# Altium project Wacky_Racers_87557913.PrjPcb
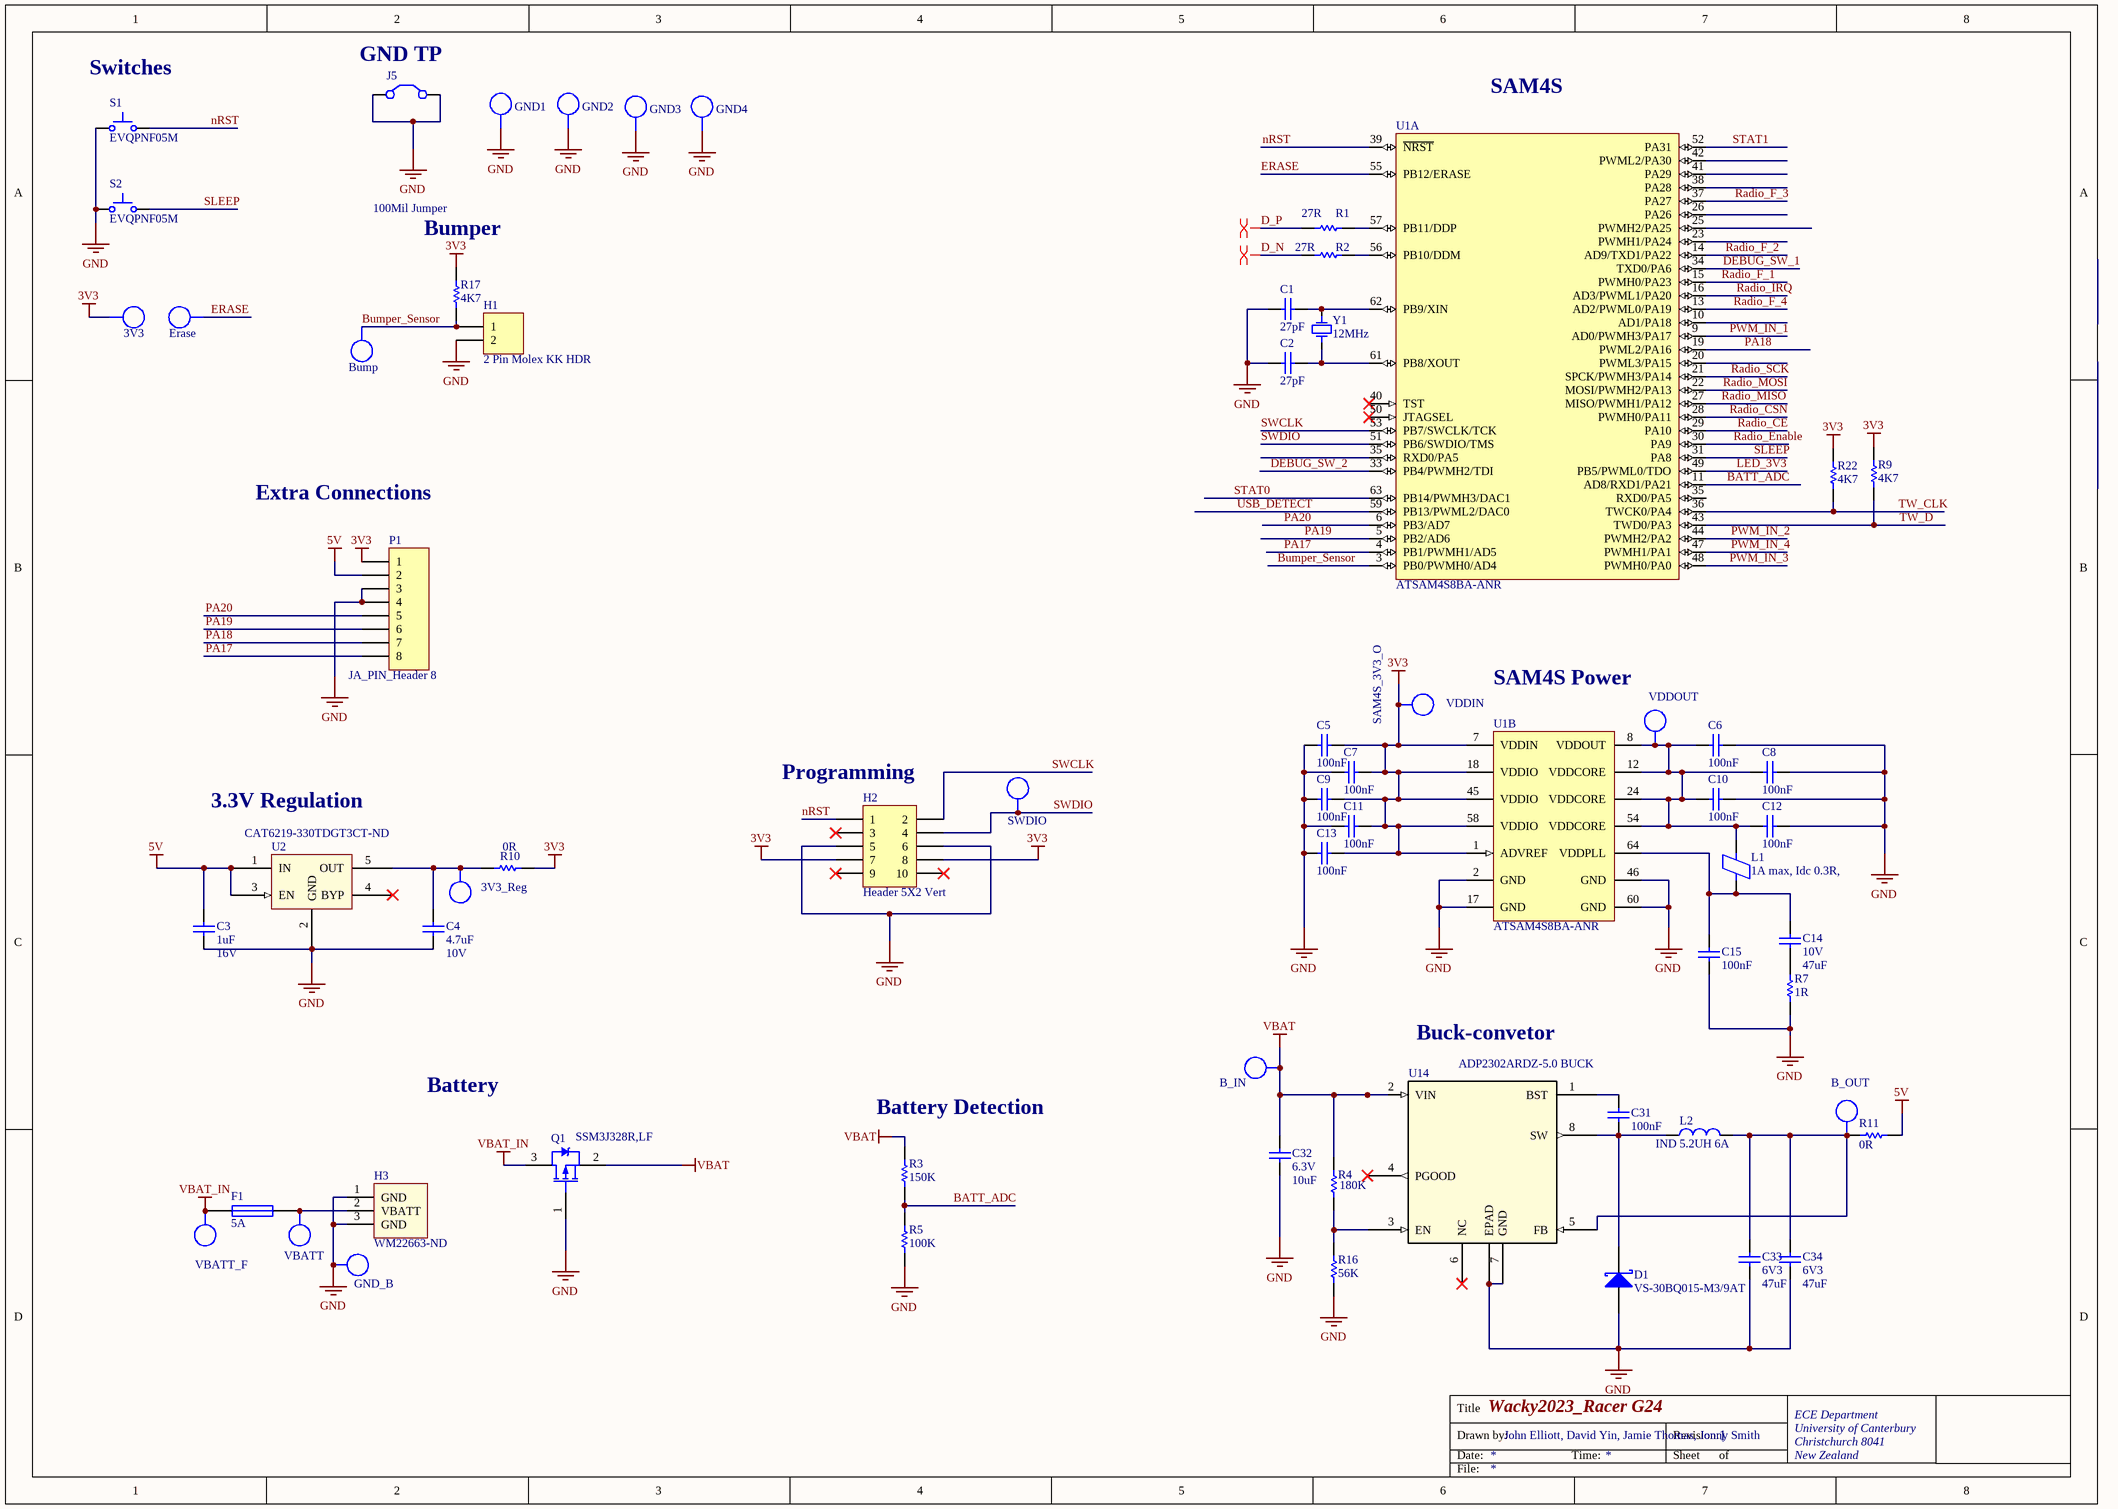
[diagram p0: Wacky_Racers_87557913.SchDoc]
2 sheets, 115 parts. Net scope: global (net labels, ports and power ports of the same name join across sheets).
Board file: Group24_87557913_98040483_PCB_Wacky_R_CAR.PcbDoc
Sheets:
  Wacky_Racers_87557913.SchDoc
  Wacky_Racers_extras.SchDoc

## Sheet Wacky_Racers_87557913.SchDoc: Wacky2023_Racer G24
size A3; DrawnBy: John Elliott, David Yin, Jamie Thomas, Jonny Smith; Address1: ECE Department; Address2: University of Canterbury; Address3: Christchurch 8041; Address4: New Zealand; Revision: 1; ImagePath: \\maxwell\elecapp\AltiumDesigner\Templates\uc-logo.png

### Parts
3V3  TP  [TP_1206]  (value not drawn)  (no BOM)
3V3_Reg  TP  [TP_1206]  (value not drawn)  (no BOM)
B_IN  TP  [TP_1206]  (value not drawn)  (no BOM)
B_OUT  TP  [TP_1206]  (value not drawn)  (no BOM)
Bump  TP  [TP_1206]  (value not drawn)  (no BOM)
C1  27pF  [CAPC1608L]
C2  27pF  [CAPC1608L]
C3  Max Voltage: 16V  [CAPC1608L]  (hidden comment: 1uF)
C4  Max Voltage: 10V  [CAPC1608N]  (hidden comment: 4.7uF)
C5  100nF  [CAPC1608L]
C6  100nF  [CAPC1608L]
C7  100nF  [CAPC1608L]
C8  100nF  [CAPC1608L]
C9  100nF  [CAPC1608L]
C10  100nF  [CAPC1608L]
C11  100nF  [CAPC1608L]
C12  100nF  [CAPC1608L]
C13  100nF  [CAPC1608L]
C14  Max Voltage: 10V  [CAPC3216L]  (hidden comment: 47uF)
C15  100nF  [CAPC1608L]
C31  100nF  [CAPC1608L]
C32  Voltage - Rated: 6.3V  [CAPC1608L]  (hidden comment: 10uF)
C33  Voltage Rating: 6V3  Capacitance: 47uF  [CAPC2012N]  (hidden comment: CC_47uF_0805_6V3)
C34  Voltage Rating: 6V3  Capacitance: 47uF  [CAPC2012N]  (hidden comment: CC_47uF_0805_6V3)
D1  VS-30BQ015-M3/9AT  [SMC]
Erase  TP  [TP_1206]  (value not drawn)  (no BOM)
F1  5A  [RESC3216N]
GND1  TP  [TP_1206]  (value not drawn)  (no BOM)
GND2  TP  [TP_1206]  (value not drawn)  (no BOM)
GND3  TP  [TP_1206]  (value not drawn)  (no BOM)
GND4  TP  [TP_1206]  (value not drawn)  (no BOM)
GND_B  TP  [TP_1206]  (value not drawn)  (no BOM)
H1  2 Pin Molex KK HDR  [MOLEX_KK_2_HDR]
H2  Header 5X2 Vert  [IDC2.54-V10D]
H3  Supplier Part Number 1: WM22663-ND  [BATT_HEADER_3POS]  (hidden comment: Battery_HEADER_3pin)
J5  100Mil Jumper  [JMP2.54]
L1  1A max, Idc 0.3R,  [INDC3216L]
L2  IND 5.2UH 6A  [INDUCTOR5u2]
P1  JA_PIN_Header 8  [HDR1X8]
Q1  SSM3J328R,LF  [SOT23_L]
R1  27R  [RESC1608L]
R2  27R  [RESC1608L]
R3  150K  [RESC1608L]
R4  value 180K  [RESC1608L]
R5  100K  [RESC1608L]
R7  1R  [RESC3216L]
R9  4K7  [RESC1608L]
R10  0R  [RESC1608L]
R11  0R  [RESC1608L]
R16  56K  [RESC1608L]
R17  4K7  [RESC1608L]
R22  4K7  [RESC1608L]
S1  EVQPNF05M  [EVQPNF05M]
S2  EVQPNF05M  [EVQPNF05M]
SWDIO  TP  [TP_1206]  (value not drawn)  (no BOM)
U1  ATSAM4S8BA-ANR  [LQFP64_L]  (parts A,B of 2)
U2  Supplier Part Number: CAT6219-330TDGT3CT-ND  [SOT95P280X145-5N]  (hidden comment: CAT6219-330TDGT3)
U14  ADP2302ARDZ-5.0 BUCK  [RD_8_1]
VBATT  TP  [TP_1206]  (value not drawn)  (no BOM)
VBATT_F  TP  [TP_1206]  (value not drawn)  (no BOM)
VDDIN  TP  [TP_1206]  (value not drawn)  (no BOM)
VDDOUT  TP  [TP_1206]  (value not drawn)  (no BOM)
Y1  12MHz  [6.0X3.5-4]

### Nets
3V3: 3V3.1 C5.2 C7.2 C9.2 C11.2 C13.1 H2.7 H2.8 P1.1 R9.1 R10.2 R17.2 R22.1 U1.1(ADVREF) U1.7(VDDIN) U1.18(VDDIO) U1.45(VDDIO) U1.58(VDDIO) VDDIN.1
5V: C3.2 P1.2 R11.1 U2.1(IN) U2.3(EN)
GND: C1.1 C2.1 C3.1 C4.1 C5.1 C6.2 C7.1 C8.2 C9.1 C10.2 C11.1 C12.2 C13.2 C15.1 C32.1 C33.1 C34.1 D1.1(A) GND1.1 GND2.1 GND3.1 GND4.1 GND_B.1 H1.2 H2.5 H2.6 H3.1(GND) H3.3(GND) J5.1(C1) J5.2(C2) P1.3 P1.4 Q1.1 R5.1 R7.1 R16.1 S1.1 S2.1 U1.2(GND) U1.17(GND) U1.46(GND) U1.60(GND) U2.2(GND) U14.7(GND) U14.EPAD
VBAT: B_IN.1 C32.2 Q1.2 R3.2 R4.2 U14.2(VIN)
VBAT_IN: F1.1 Q1.3 VBATT_F.1
BATT_ADC: R3.1 R5.2 U1.11(AD8/RXD1/PA21)
Bumper_Sensor: Bump.1 H1.1 R17.1 U1.3(PB0/PWMH0/AD4)
D_N: R2.1
D_P: R1.1
DEBUG_SW_1: U1.34(TXD0/PA6)
DEBUG_SW_2: U1.33(PB4/PWMH2/TDI)
ERASE: Erase.1 U1.55(PB12/ERASE)
LED_3V3: U1.49(PB5/PWML0/TDO)
nRST: H2.1 S1.2 U1.39(~{NRST})
PA17: P1.8 U1.4(PB1/PWMH1/AD5)
PA18: P1.7 U1.19(PWML2/PA16)
PA19: P1.6 U1.5(PB2/AD6)
PA20: P1.5 U1.6(PB3/AD7)
PWM_IN_1: U1.9(AD0/PWMH3/PA17)
PWM_IN_2: U1.44(PWMH2/PA2)
PWM_IN_3: U1.48(PWMH0/PA0)
PWM_IN_4: U1.47(PWMH1/PA1)
Radio_CE: U1.29(PA10)
Radio_CSN: U1.28(PWMH0/PA11)
Radio_Enable: U1.30(PA9)
Radio_F_1: U1.15(PWMH0/PA23)
Radio_F_2: U1.14(AD9/TXD1/PA22)
Radio_F_3: U1.37(PA27)
Radio_F_4: U1.13(AD2/PWML0/PA19)
Radio_IRQ: U1.16(AD3/PWML1/PA20)
Radio_MISO: U1.27(MISO/PWMH1/PA12)
Radio_MOSI: U1.22(MOSI/PWMH2/PA13)
Radio_SCK: U1.21(SPCK/PWMH3/PA14)
SLEEP: S2.2 U1.31(PA8)
STAT0: U1.63(PB14/PWMH3/DAC1)
STAT1: U1.52(PA31)
SWCLK: H2.2 U1.53(PB7/SWCLK/TCK)
SWDIO: H2.4 SWDIO.1 U1.51(PB6/SWDIO/TMS)
TW_CLK: R22.2 U1.36(TWCK0/PA4)
TW_D: R9.2 U1.43(TWD0/PA3)
USB_DETECT: U1.59(PB13/PWML2/DAC0)
Net3V3_Reg_1: 3V3_Reg.1 C4.2 R10.1 U2.5(OUT)
NetB_OUT_1: B_OUT.1 C33.2 C34.2 L2.2 R11.2 U14.5(FB)
NetC1_2: C1.2 U1.62(PB9/XIN) Y1.3(OSC2)
NetC2_2: C2.2 U1.61(PB8/XOUT) Y1.1(OSC1)
NetC6_1: C6.1 C8.1 C10.1 C12.1 L1.2 U1.8(VDDOUT) U1.12(VDDCORE) U1.24(VDDCORE) U1.54(VDDCORE) VDDOUT.1
NetC14_1: C14.1 R7.2
NetC14_2: C14.2 C15.2 L1.1 U1.64(VDDPLL)
NetC31_1: C31.1 D1.2(K) L2.1 U14.8(SW)
NetC31_2: C31.2 U14.1(BST)
NetF1_2: F1.2 H3.2(VBATT) VBATT.1
NetR1_2: R1.2 U1.57(PB11/DDP)
NetR2_2: R2.2 U1.56(PB10/DDM)
NetR4_1: R4.1 R16.2 U14.3(EN)

Not connected (* = marked no-connect by the designer): H2 3* 9* 10*; U1 10(AD1/PA18) 20(PWML3/PA15) 23(PWMH1/PA24) 25(PWMH2/PA25) 26(PA26) 35(RXD0/PA5) 38(PA28) 40(TST)* 41(PA29) 42(PWML2/PA30) 50(JTAGSEL)*; U2 4(BYP)*; U14 4(PGOOD)* 6(NC)*

### Layout directives
differential pair: D_N, D_P

### Notes on the sheet
- (near S1) Switches
- (near J5) GND TP
- (near U1) SAM4S
- (near R17) Bumper
- Extra Connections
- (near VDDIN) SAM4S_3V3_O
- SAM4S Power
- (near H2) Programming
- 3.3V Regulation
- (near U14) Buck-convetor
- Battery
- (near R3) Battery Detection
- Title
- Drawn by:
- Date:
- Time:
- Revision:
- Sheet
- of
- File:

### Library data of the parts
3V3 3V3_Reg B_IN B_OUT Bump Erase GND1-GND4 GND_B SWDIO VBATT VBATT_F VDDIN VDDOUT = TP_1206: Test-Point 3.3x1.6x2.1mm SMD; Manufacturer: Harwin Inc; Manufacturer Part Number: S1751-46R; Manufacturer PN: *; Storage Location: ProtoPlace; Mounting Type: Surface Mount; Type: PC Test Point; Supplier 1: Digi-Key; Supplier Part Number 1: 952-1478-2-ND; Supplier 2: Farnell; Supplier Part Number 2: 1826282; Supplier: ECE Dept; Value: TP
C1 C2 = CC_27pF_0603: CAP CER 27pF NPO/COG +-5% 50V 0603; PackageReference: 0603; Code_IPC: 1608 [0603]; Verify: *; Supplier: ECE Dept; Storage Location: PCB Assembly WS; Value: 27pF
C3 = CC_1uF_0603: CAP CER 1uF Y5V -20% +80% 16V 0603; PackageReference: 0603; Code_IPC: 1608 [0603]; Verify: *; Supplier: ECE Dept; Storage Location: PCB Assembly WS; Value: 1uF
C4 = CC_4.7uF_0603: CAP CER 4.7uF X5R +-20%  10V 0603; Note: Footprint corresponds to dimensions for bulk cassette packaging. This case size has tightened tolerances.; PackageReference: 0805; Code_IPC: 2012[0805]; Verify: *; Supplier: ECE Dept; Storage Location: PCB Assembly WS; Value: 4.7uF
C5-C13 C15 C31 = CC_100nF_0603: CAP CER 100nF X7R +-10% 50V 0603; PackageReference: 0603; Code_IPC: 1608 [0603]; Verify: *; Supplier: ECE Dept; Storage Location: PCB Assembly WS; Value: 100nF
C14 = CC_47uF_1206: CAP CER 47uF X5R -/+20% 10V 1206; Verify: *; Supplier: ECE Dept; Storage Location: PCB Assembly WS; Dielectric: X5R; Footprint: 1210 (3225 metric); MoV: 10V; Value: 47uF
C32 = CC_10uF_0603: CAP CER 10UF X5R +-20% 6V3 0603; Supplier: ECE Dept; Storage Location: PCB Assembly WS; Value: 10uF
C33 C34 = CC_47uF_0805_6V3: SAMSUNG ELECTRO-MECHANICS - CL21A476MQCLRNC - CAP, 47UF, 6.3V, MLCC, 0805; Tolerance: 20%; Dielectric: X5R; Supplier 1: Digi-Key; Manufacturer 1: Samsung; Manufacturer Part Number 1: CL21A476MQCLRNC; Stock 1: 94580; Pricing 1: 1=0.56000, 10=0.39100, 50=0.27380, 100=0.23470, 500=0.17602, 1000=0.14865 (USD); RoHS: Yes; Mount: Surface Mount; Case/Package: 0805; Case Code (Metric): 2012; Case Code (Imperial): 0805; Contact Plating: Tin; Min Operating Temperature: -55°C; Max Operating Temperature: 85°C; Packaging: Tape and Reel; Package Quantity: 4000; Termination: Wraparound; Series: CL; Construction: Flat; Length: 2mm; Width: 0.049inch; Thickness: 0.037inch; Depth: 1.25mm; Lead Free: Lead Free; RoHS Compliant: Yes; ComponentLink1URL: https://datasheet.ciiva.com/25723/cl21a476mqclrnc-25723991.pdf?src-supplier=Digi-Key; ComponentLink1Description: https://datasheet.ciiva.com/25723/cl21a476mqclrnc-25723991.pdf?src-supplier=Digi-Key; Supplier Part Number 1: 1276-2420-1-ND
D1 = DS_VS-30BQ015-M3: DIODE, SCHOTTKY, 3A, 15V, DO-214AB / SMC; Manufacturer: Vishay Semiconductors; Forward Voltage: 350mV; Max Forward Surge Current (Ifsm): 650A; Peak Reverse Current: 4mA; Average Rectified Current: 3A; Max Reverse Voltage (DC): 15V; Supplier: Digi-Key; ComponentLink1URL: https://datasheet.ciiva.com/36181/vs-30bq015-m3-9at-36181258.pdf; ComponentLink1Description: https://datasheet.ciiva.com/36181/vs-30bq015-m3-9at-36181258.pdf; Supplier 1: Digi-Key; Supplier 2: Element14; Supplier Part Number 1: VS-30BQ015-M3/9ATGIDKR-ND; Supplier Part Number 2: 2628288; Supplier Part Number: VS-30BQ015-M3/9AT-ND; Manufacturer Part Number: VS-30BQ015-M3/9AT
F1 = FS_Fuse_5.0A: Fuse 5.0A Fast Acting 1206 SMD; Manufacturer Part Number: C1F5; Manufacturer: Bel TRP; Voltage Rating (AC): 125V; Voltage Rating (DC): 63V; DC Cold Resistance: 19mR; Fuse Type: Board Mount (Cartridge Style Excluded); Approvals: CE,cURus; Mount: Surface Mount; Case/Package: 1206; Number of Pins: 2; Case Code (Metric): 3216; Case Code (Imperial): 1206; Contact Plating: Nickel,Tin; Min Operating Temperature: -55°C; Max Operating Temperature: 125°C; Packaging: Tape and Reel; Voltage Rating: 125V; Length: 0.126inch; Width: 0.062inch; Supplier 1: Digi-Key; Stock 1: 725; Pricing 1: 1=0.32, 5=0.312, 10=0.298, 50=0.2662, 100=0.2479, 250=0.22032, 500=0.1836, 1000=0.17442 (USD); ComponentLink1URL: http://www.farnell.com/datasheets/2571625.pdf; ComponentLink1Description: http://www.farnell.com/datasheets/2571625.pdf; ComponentLink2URL: http://belfuse.com/pdfs/C1F.pdf; ComponentLink2Description: http://belfuse.com/pdfs/C1F.pdf; ComponentLink3URL: http://www.mouser.com/ds/2/643/C1F-594910.pdf; ComponentLink3Description: http://www.mouser.com/ds/2/643/C1F-594910.pdf; ComponentLink4URL: https://belfuse.com/resources/StewartConnector/C1F.pdf; ComponentLink4Description: https://belfuse.com/resources/StewartConnector/C1F.pdf; Current Rating: 5A; Supplier Part Number 1: 507-1886-1-ND; Supplier 2: Element14; Supplier Part Number 2: 2848595; Value: 5A
H1 = JA_MOLEX_KK_2POS: CONN HEADER 2POS 2.54mm VERT_Thru Hole; Supplier 1: Farnell; Supplier Part Number 1: 1462926; Supplier: ECE Dept; Storage Location: ECE Dept Store; Value: 2 Pin Molex KK HDR
H2 = JA_HDR_IDC_5X2_VERT: IDC Header, 2,54mm, 10-Pin, Vert; Supplier: ECE Dept; Supplier 1: Farnell; Supplier Part Number 1: 1096985; Storage Location: ECE Dept Store
H3 = Battery_HEADER_3pin: 3Pin Header 2.54mm spacing / Digikey #WM22663-ND; Supplier 1: Digi-Key
J5 = TP_JUMPER: 2.54mm Jumper Thru Hole; Pitch Spacing: 2.54; No. of Rows: 1; No. of Positions: 2; Supplier: ECE Dept; Supplier 1: Farnell; Supplier Part Number 1: 1097975; Storage Location: ECE$ Store
L1 = IN_Ferrite-Bead: Ferrite Bead, Rdc 0.3R, Z100MHZ 600R, Imax 1A, SMD 1206; Manufacturer: FAIR-RITE; Manufacturer PN: 2512066017Y1; DC Current Rating: 1; DC Resistance Max: 0.08; Ferrite Case Style: 1206 ^3216 Metric]; Frequency Range: 50MHz to 1; Impedance: 600; Impedance Tolerance: ± 25%; Supplier: ECE Dept; Storage Location: PCB Assembly WS; Ferrite Mounting: SMD; Supplier 1: Farnell; Supplier Part Number 1: 1612060; Manufacturer Part Number: 2512066017Y1; Value: 1A max, Idc 0.3R,
L2 = CDRH104RNP-5R2NC: FIXED IND 5.2UH 6A 22 MOHM SMD; Manufacturer: Sumida America Components Inc.; Material - Core: Ferrite; Tolerance: ±30%; Current - Saturation: 5.6A; Shielding: Shielded; DC Resistance (DCR): 22 mOhm Max; Supplier 1: Digi-Key; Manufacturer Part Number: CDRH104RNP-5R2NC; RoHS: RoHS Compliant; Category: Inductors, Coils, Chokes; Stock 1: 3849; Pricing 1: 1=2.9, 10=2.678, 100=1.8743, 500=1.5173 (NZD); Packaging: Cut Tape (CT); Part Status: Active; Type: -; Q @ Freq: -; Frequency - Self Resonant: -; Ratings: -; Operating Temperature: -40°C ~ 100°C; Mounting Type: Surface Mount; Package / Case: Nonstandard; Supplier Device Package: -; Size / Dimension: 0.402" L x 0.394" W (10.20mm x 10.00mm); Height - Seated (Max): 0.157" (4.00mm); ComponentLink1URL: http://products.sumida.com/products/pdf/CDRH104R.pdf; ComponentLink1Description: http://products.sumida.com/products/pdf/CDRH104R.pdf; Supplier Part Number 1: 308-2280-1-ND
P1 = JA_PIN_Header 8: Header, 8-Pin; LatestRevisionDate: 17-Jul-2002; LatestRevisionNote: Re-released for DXP Platform.; Publisher: Altium Limited
Q1 = TM_SSM3J328R: MOSFET P-CH 20V 6A SOT23-3; Manufacturer: Toshiba; FET Feature: Logic Level Gate, 1.5V Drive; FET Type: MOSFET P-Channel, Metal Oxide; Gate Charge (Qg) @ Vgs: 12.8nC @ 4.5V; Input Capacitance (Ciss) @ Vds: 840pF @ 10V; Power - Max: 1W; Rds On Max: 29.8mR; Drain to Source Resistance: 47.4mR; Turn-On Delay Time: 32ns; Power Dissipation: 2W; Number of Channels: 1; Turn-Off Delay Time: 107ns; Gate to Source Voltage (Vgs): 8V; Input Capacitance: 840pF; Element Configuration: Single; Drain to Source Breakdown Voltage: -20V; Vgs(th) (Max) @ Id: 1V @ 1mA; Current - Continuous Drain (Id) @ 25° C: 6A; Drain to Source Voltage (Vdss): 20V; Package / Case: SOT-23-3 Flat Leads; Supplier Device Package: SOT-23F; Pricing: 1=0.79, 10=0.658, 25=0.5772, 100=0.4939, 250=0.42836, 500=0.36284, 1000=0.27972 (NZD); Storage Location: PCB Assembly WS; Supplier: Digi-Key; ComponentLink1URL: https://datasheet.ciiva.com/11158/ssm3j328r-datasheet-en-20140301-11158652.pdf; ComponentLink1Description: https://datasheet.ciiva.com/11158/ssm3j328r-datasheet-en-20140301-11158652.pdf; Supplier Part Number: SSM3J328RLFDKR-ND; Max Operating Temperature: 150°C; Mount: Surface Mount; Packaging: Tape and Reel; Min Operating Temperature: -55°C; Continuous Drain Current (ID): 6A; Radiation Hardening: No; Max Power Dissipation: 1W; Package Quantity: 3000; Case/Package: SOT-23-3; Number of Pins: 3; Number of Elements: 1; Supplier 1: Digi-Key; Supplier Part Number 1: SSM3J328RLFDKR-ND; Manufacturer Part Number: SSM3J328R,LF
R1 R2 = RS_27R: RES 27 OHM 1/10W 5% 0603 SMD; Storage Location: PCB Assembly WS; Supplier: ECE Dept; Value: 27R
R3 = RS_150K: RES 150K OHM 1/10W 5% 0603 SMD; Storage Location: PCB Assembly WS; Supplier: ECE Dept; Value: 150K
R4 = RS_180K: RES 180K OHM 1/10W 5% 0603 SMD; Storage Location: PCB Assembly WS; Supplier: ECE Dept
R5 = RS_100K: RES 100K OHM 1/10W 5% 0603 SMD; Storage Location: PCB Assembly WS; Supplier: ECE Dept; Value: 100K
R7 = RT_1R: RES 1R OHM 1/4W 5% 1206 SMD; Storage Location: PCB Assembly WS; Supplier: ECE Dept; Value: 1R
R9 R17 R22 = RS_4K7: RES 4.7K OHM 1/10W 5% 0603 SMD; Storage Location: PCB Assembly WS; Supplier: ECE Dept; Value: 4K7
R10 R11 = RS_0R0: RES 0.0 OHM 1/10W 5% 0603 SMD; Storage Location: PCB Assembly WS; Supplier: ECE Dept; Value: 0R
R16 = RS_56K: RES 56.0K OHM 1/10W 5% 0603 SMD; Storage Location: PCB Assembly WS; Supplier: ECE Dept; Value: 56K
S1 S2 = WS_EVQPNF05M: Panasonic 6 x 3.5mm SMD Light Touch Switch Type SMD; PackageDescription: 6.0 x 3.5 mm; Supplier 1: Farnell; Supplier Part Number 1: 2079481; Manufacturer: Panasonic; Manufacturer PN: EVQPNF05M; Supplier 2: Digi-Key; Supplier Part Number 2: P13598SCT-ND; Storage Location: PCB Assembly WS; Supplier: ECE Dept
U1 = SE_ATSAM4S16BA-MU: IC MCU 32BIT 512KB FLASH 64LQFP; Manufacturer: Atmel; Connectivity: I²C, IrDA, Memory Card, SPI, SSC, UART/USART, USB; Core Processor: ARM® Cortex®-M4; Core Size: 32-Bit; Data Converters: A/D 11x12b, D/A 2x12b; Number of I/O: 47; Peripherals: Brown-out Detect/Reset, DMA, POR, PWM, WDT; Program Memory Size: 512KB (512K x 8); RAM Size: 128K x 8; Speed: 120MHz; Voltage - Supply (Vcc/Vdd): 1.62 V ~ 3.6 V; PackageVersion: revJ, Jul-2007; PackageReference: 64PS; PackageDescription: 64-Pin Quad Flat No-Lead (QFN) Sawn, 9 x 9 x 1.0 mm Body, 0.5 mm Pitch, Exposed Pad; Code_JEDEC: MO-220VMMD-3; ComponentLink1Description: Manufacturer URL; ComponentLink1URL: http://www.atmel.com/; ComponentLink2Description: SAM4S Series Datasheet; ComponentLink2URL: http://www.atmel.com/dyn/resources/prod_documents/11100.pdf; ComponentLink3Description: SAM4S Series Summary; ComponentLink3URL: http://www.atmel.com/dyn/resources/prod_documents/11100S.pdf; Supplier 1: Digi-Key; Package / Case: 64-LQFP; Packaging: Cut Tape (CT); Program Memory Type: FLASH; Supplier Part Number 1: ATSAM4S8BA-ANRCT-ND; Manufacturer Part Number: ATSAM4S8BA-ANR
U2 = SV_CAT6219-330TDGT3: IC REG LIN 3.3V 500MA TSOT23-5; Voltage - Input (Max): 5.5V; Voltage Dropout (Max): 0.5V @ 500mA; Manufacturer Part Number: CAT6219-330TDGT3; Base Part Number: CAT6219; Current - Output: 500mA; Package / Case: SOT-23-5 Thin, TSOT-23-5; Supplier: Digi-Key; Supplier Device Package: TSOT-23-5; Voltage - Output (Min/Fixed): 3.3V; ComponentLink1URL: http://www.onsemi.com/pub/Collateral/CAT6219-D.PDF; ComponentLink1Description: http://www.onsemi.com/pub/Collateral/CAT6219-D.PDF; Supplier 1: Digi-Key; ComponentLink2Description: CAT6219 Datasheet; ComponentLink2URL: \\maxwell\elecapp\AltiumDesigner\Libraries\DatasheetsNew\ENCE461\CAT6219-D.PDF
U14 = ADP2302ARDZ-5.0-R7: IC REG BUCK 5V 2A 8SOIC; Vendor: Analog Devices Inc; Frequency - Switching: 700kHz; Output Type: Fixed; Voltage - Input (Max): 20V; Manufacturer_Part_Number: ADP2302ARDZ-5.0-R7; Type: DEV; Value: Value; Supplier 1: Digi-Key; Current - Output: 2A; Voltage - Output (Min/Fixed): 5V; Supplier Part Number 1: ADP2302ARDZ-5.0-R7CT-ND; ComponentLink1Description: ADP2302ARDZ-5.0 Datasheet; ComponentLink1URL: \\maxwell\elecapp\AltiumDesigner\Libraries\DatasheetsNew\ENCE461\ADP2302_2303.pdf
Y1 = XT_CRYSTAL_12MHz_18pF: CRYSTAL 12MHZ 18PF 6X3.5mm SMD; Manufacturer: CTS-Frequency Controls; Manufacturer Part Number: 406C35D12M00000; ESR (Equivalent Series Resistance): 60 Ohm; Frequency Stability: ±50ppm; Frequency Tolerance: ±30ppm; Operating Mode: Fundamental; Supplier 1: Digi-Key; Height: 0.047" (1.20mm); Load Capacitance: 18pF; Mounting Type: Surface Mount; Operating Temperature: -20°C ~ 70°C; Package / Case: 4-SMD, No Lead (DFN, LCC); Size / Dimension: 0.236" L x 0.138" W (6.00mm x 3.50mm); Supplier Part Number 1: CTX855CT-ND; Frequency: 12MHz

## Sheet Wacky_Racers_extras.SchDoc: Wacky2023_Racer G24
size A3; DrawnBy: John Elliott, David Yin, Jamie Thomas, Jonny Smith; Address1: ECE Department; Address2: University of Canterbury; Address3: Christchurch 8041; Address4: New Zealand; Revision: 1; ImagePath: \\maxwell\elecapp\AltiumDesigner\Templates\uc-logo.png
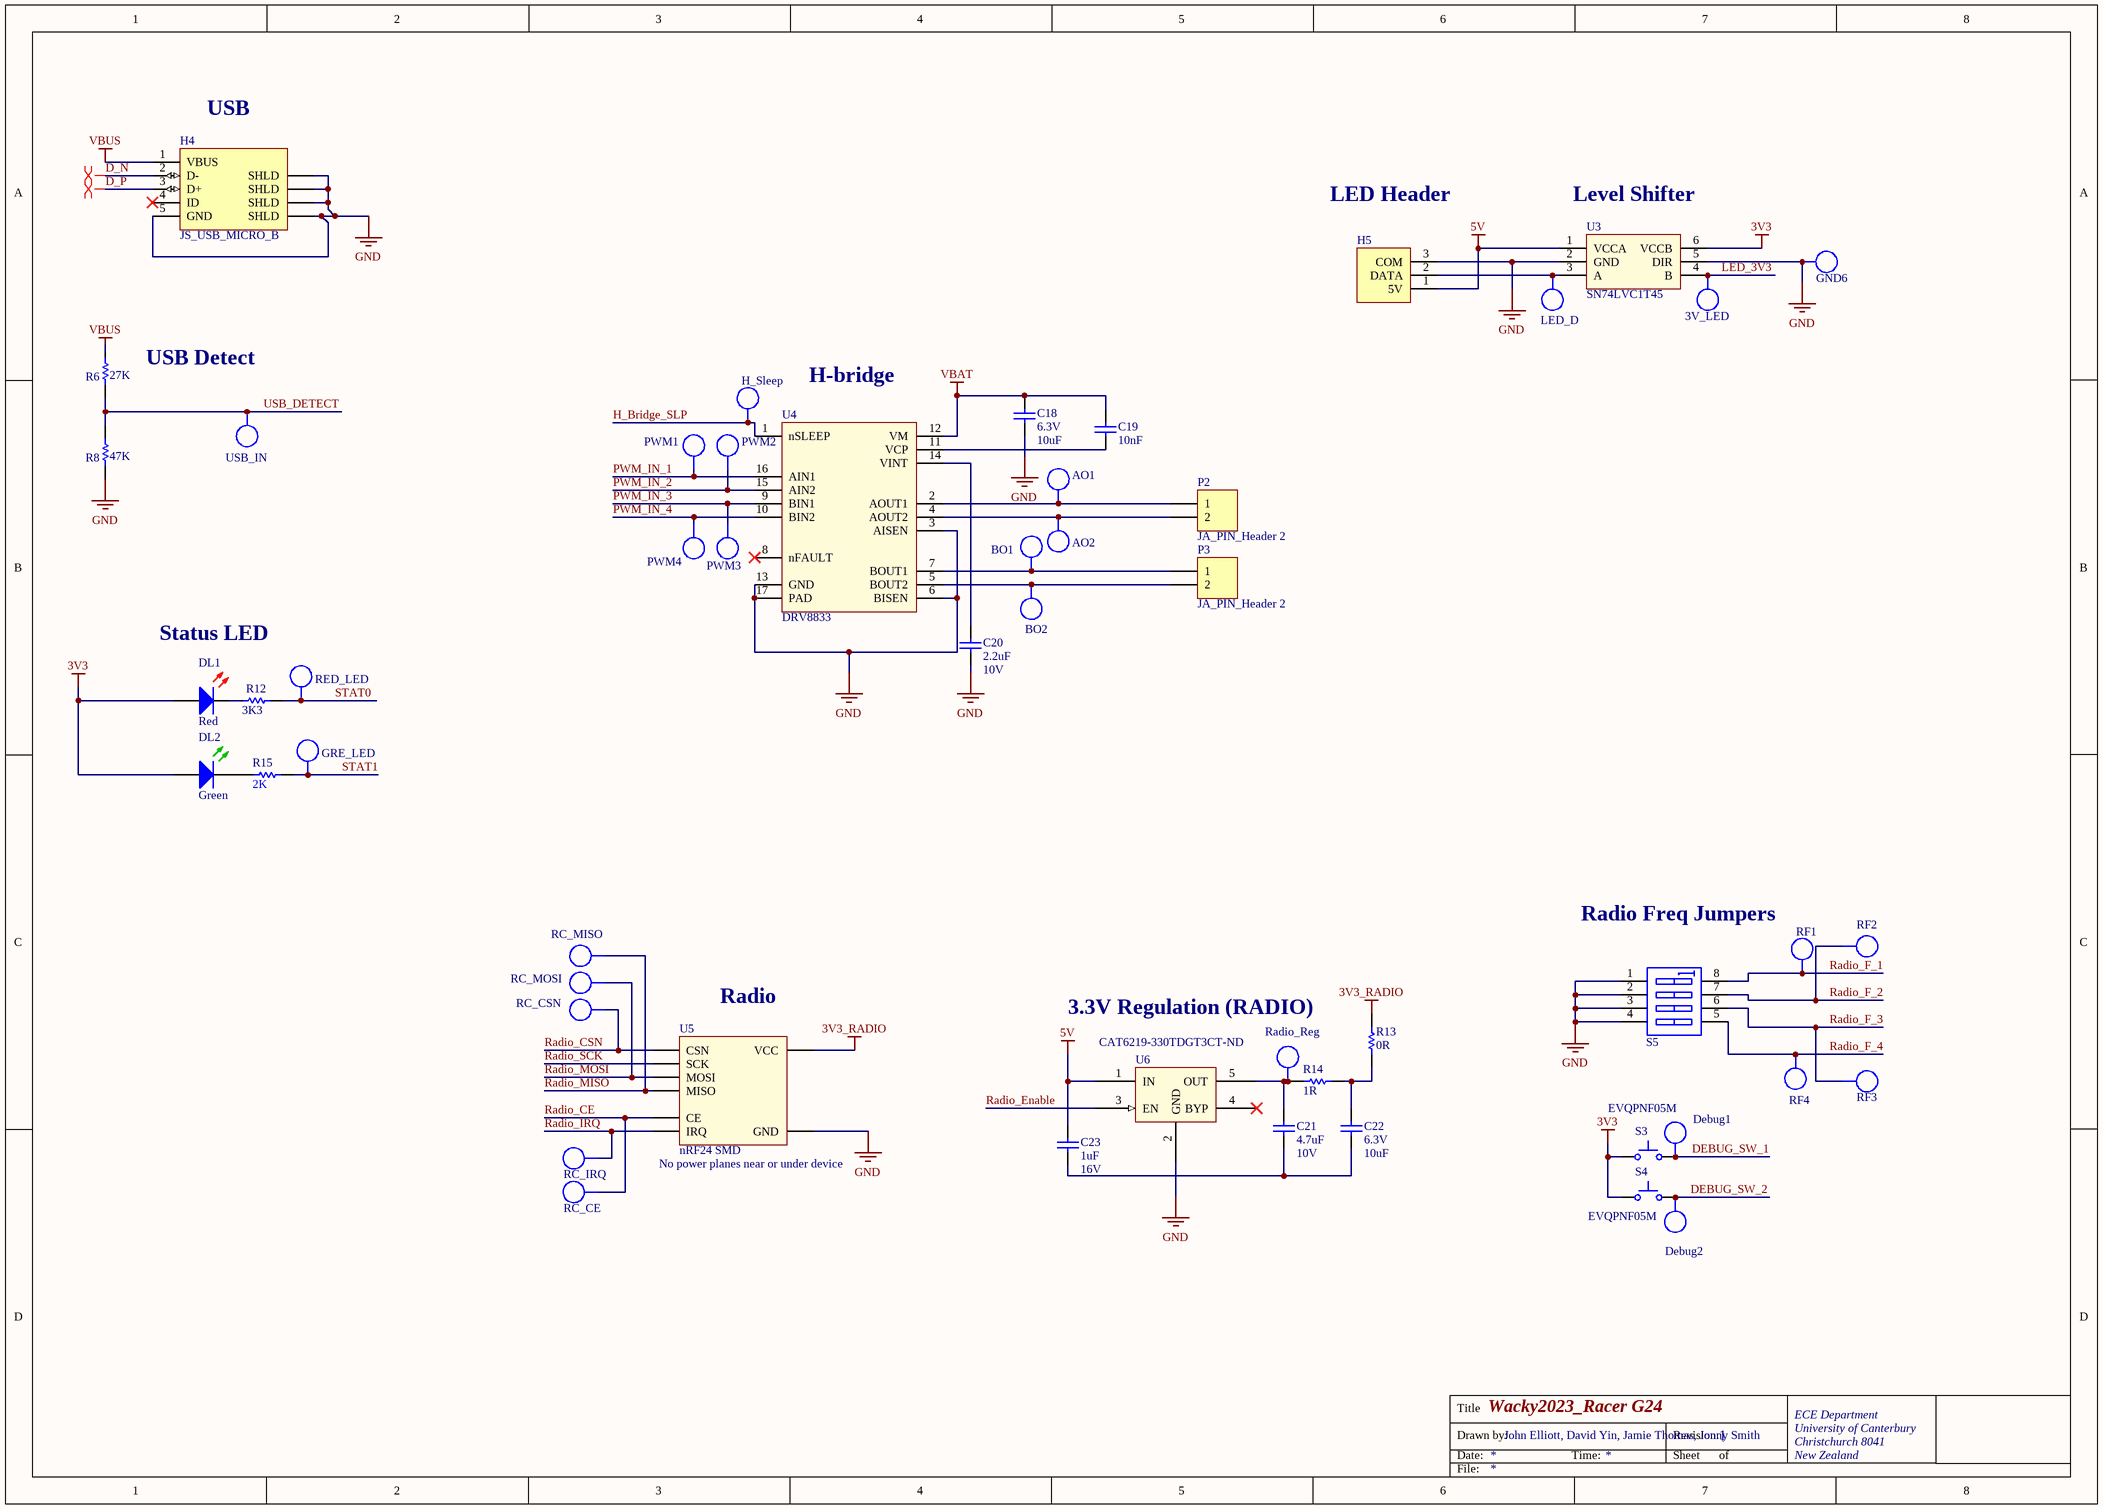
[diagram p1: Wacky_Racers_extras.SchDoc]

### Parts
3V_LED  TP  [TP_1206]  (value not drawn)  (no BOM)
AO1  TP  [TP_1206]  (value not drawn)  (no BOM)
AO2  TP  [TP_1206]  (value not drawn)  (no BOM)
BO1  TP  [TP_1206]  (value not drawn)  (no BOM)
BO2  TP  [TP_1206]  (value not drawn)  (no BOM)
C18  Voltage - Rated: 6.3V  [CAPC1608L]  (hidden comment: 10uF)
C19  10nF  [CAPC1608L]
C20  Max Voltage: 10V  [CAPC1608L]  (hidden comment: 2.2uF)
C21  Max Voltage: 10V  [CAPC1608N]  (hidden comment: 4.7uF)
C22  Voltage - Rated: 6.3V  [CAPC1608L]  (hidden comment: 10uF)
C23  Max Voltage: 16V  [CAPC1608L]  (hidden comment: 1uF)
Debug1  TP  [TP_1206]  (value not drawn)  (no BOM)
Debug2  TP  [TP_1206]  (value not drawn)  (no BOM)
DL1  Red  [WL-SMCW0603]
DL2  Green  [WL-SMCW0603]
GND6  TP  [TP_1206]  (value not drawn)  (no BOM)
GRE_LED  TP  [TP_1206]  (value not drawn)  (no BOM)
H4  JS_USB_MICRO_B  [FCI_USB_10118194-0001LF]
H5  3 Pin Molex KK Hdr  [MOLEX_KK_3_HDR]  (value not drawn)
H_Sleep  TP  [TP_1206]  (value not drawn)  (no BOM)
LED_D  TP  [TP_1206]  (value not drawn)  (no BOM)
P2  JA_PIN_Header 2  [HDR1X2]
P3  JA_PIN_Header 2  [HDR1X2]
PWM1  TP  [TP_1206]  (value not drawn)  (no BOM)
PWM2  TP  [TP_1206]  (value not drawn)  (no BOM)
PWM3  TP  [TP_1206]  (value not drawn)  (no BOM)
PWM4  TP  [TP_1206]  (value not drawn)  (no BOM)
R6  27K  [RESC1608L]
R8  47K  [RESC1608N]
R12  3K3  [RESC1608L]
R13  0R  [RESC1608L]
R14  1R  [RESC3216L]
R15  2K  [RESC1608L]
Radio_Reg  TP  [TP_1206]  (value not drawn)  (no BOM)
RC_CE  TP  [TP_1206]  (value not drawn)  (no BOM)
RC_CSN  TP  [TP_1206]  (value not drawn)  (no BOM)
RC_IRQ  TP  [TP_1206]  (value not drawn)  (no BOM)
RC_MISO  TP  [TP_1206]  (value not drawn)  (no BOM)
RC_MOSI  TP  [TP_1206]  (value not drawn)  (no BOM)
RED_LED  TP  [TP_1206]  (value not drawn)  (no BOM)
RF1  TP  [TP_1206]  (value not drawn)  (no BOM)
RF2  TP  [TP_1206]  (value not drawn)  (no BOM)
RF3  TP  [TP_1206]  (value not drawn)  (no BOM)
RF4  TP  [TP_1206]  (value not drawn)  (no BOM)
S3  EVQPNF05M  [EVQPNF05M]
S4  EVQPNF05M  [EVQPNF05M]
S5  WS_SW DIP-4  [DIP_SW_4WAY_SMD -]  (value not drawn)
U3  SN74LVC1T45  [SOT23-6_N]
U4  DRV8833  [HTSOP16 DRV8833]
U5  nRF24 SMD  Warning: No power planes near or under device  [NRF24]
U6  Supplier Part Number: CAT6219-330TDGT3CT-ND  [SOT95P280X145-5N]  (hidden comment: CAT6219-330TDGT3)
USB_IN  TP  [TP_1206]  (value not drawn)  (no BOM)

### Nets
3V3: DL1.2(A) DL2.2(A) S3.1 S4.1 U3.6(VCCB)
3V3_RADIO: R13.2 U5.1(VCC)
5V: C23.2 H5.1(5V) U3.1(VCCA) U6.1(IN)
GND: C18.1 C20.1 GND6.1 H4.5(GND) H4.6(SHLD) H5.3(COM) R8.1 S5.1(A1) S5.2(A2) S5.3(A3) S5.4(A4) U3.2(GND) U3.5(DIR) U4.3(AISEN) U4.6(BISEN) U4.13(GND) U4.17(PAD) U5.2(GND) U6.2(GND)
VBAT: C18.2 C19.2 U4.12(VM)
VBUS: H4.1(VBUS) R6.2
D_N: H4.2(D-)
D_P: H4.3(D+)
DEBUG_SW_1: Debug1.1 S3.2
DEBUG_SW_2: Debug2.1 S4.2
H_Bridge_SLP: H_Sleep.1 U4.1(nSLEEP)
LED_3V3: 3V_LED.1 U3.4(B)
PWM_IN_1: PWM1.1 U4.16(AIN1)
PWM_IN_2: PWM2.1 U4.15(AIN2)
PWM_IN_3: PWM3.1 U4.9(BIN1)
PWM_IN_4: PWM4.1 U4.10(BIN2)
Radio_CE: RC_CE.1 U5.3(CE)
Radio_CSN: RC_CSN.1 U5.4(CSN)
Radio_Enable: U6.3(EN)
Radio_F_1: RF1.1 S5.8(B1)
Radio_F_2: RF2.1 S5.7(B2)
Radio_F_3: RF3.1 S5.6(B3)
Radio_F_4: RF4.1 S5.5(B4)
Radio_IRQ: RC_IRQ.1 U5.8(IRQ)
Radio_MISO: RC_MISO.1 U5.7(MISO)
Radio_MOSI: RC_MOSI.1 U5.6(MOSI)
Radio_SCK: U5.5(SCK)
STAT0: R12.2 RED_LED.1
STAT1: GRE_LED.1 R15.2
USB_DETECT: R6.1 R8.2 USB_IN.1
NetAO1_1: AO1.1 P2.1 U4.2(AOUT1)
NetAO2_1: AO2.1 P2.2 U4.4(AOUT2)
NetBO1_1: BO1.1 P3.1 U4.7(BOUT1)
NetBO2_1: BO2.1 P3.2 U4.5(BOUT2)
NetC19_1: C19.1 U4.11(VCP)
NetC20_2: C20.2 U4.14(VINT)
NetC21_1: C21.1 C22.1 C23.1
NetC21_2: C21.2 R14.1 Radio_Reg.1 U6.5(OUT)
NetC22_2: C22.2 R13.1 R14.2
NetDL1_1: DL1.1(K) R12.1
NetDL2_1: DL2.1(K) R15.1
NetH5_2: H5.2(DATA) LED_D.1 U3.3(A)

Not connected (* = marked no-connect by the designer): H4 4(ID)*; U4 8(nFAULT)*; U6 4(BYP)*

### Layout directives
differential pair: D_N, D_P

### Notes on the sheet
- (near H4) USB
- LED Header
- (near U3) Level Shifter
- USB Detect
- H-bridge
- Status LED
- Radio Freq Jumpers
- (near U5) Radio
- 3.3V Regulation (RADIO)
- Title
- Drawn by:
- Date:
- Time:
- Revision:
- Sheet
- of
- File:

### Library data of the parts
3V_LED AO1 AO2 BO1 BO2 Debug1 Debug2 GND6 GRE_LED H_Sleep LED_D PWM1-PWM4 Radio_Reg RC_CE RC_CSN RC_IRQ RC_MISO RC_MOSI RED_LED RF1-RF4 USB_IN = TP_1206: as 3V3 on sheet Wacky_Racers_87557913; Supplier 1: Digi-Key; Mounting Type: Surface Mount; Type: PC Test Point; Supplier Part Number 1: 952-1478-2-ND; Manufacturer PN: *; Storage Location: ProtoPlace; Supplier 2: Farnell; Supplier Part Number 2: 1826282; Supplier: ECE Dept; Value: TP
C18 C22 = CC_10uF_0603: CAP CER 10UF X5R +-20% 6V3 0603; Supplier: ECE Dept; Storage Location: PCB Assembly WS; Value: 10uF
C19 = CC_10nF_0603: CAP CER 10nF X7R +-10% 50V 0603; PackageReference: 0603; Code_IPC: 1608 [0603]; Verify: *; Supplier: ECE Dept; Storage Location: PCB Assembly WS; Value: 10nF
C20 = CC_2.2uF_0603: CAP CER 2.2uF X5R +-20% 10V 0603; PackageReference: 0603; Code_IPC: 1608 [0603]; Verify: *; Supplier: ECE Dept; Storage Location: PCB Assembly WS; Value: 2.2uF
C21 = CC_4.7uF_0603: as C4 on sheet Wacky_Racers_87557913; PackageReference: 0805; Code_IPC: 2012[0805]; Verify: *; Supplier: ECE Dept; Storage Location: PCB Assembly WS; Value: 4.7uF
C23 = CC_1uF_0603: CAP CER 1uF Y5V -20% +80% 16V 0603; PackageReference: 0603; Code_IPC: 1608 [0603]; Verify: *; Supplier: ECE Dept; Storage Location: PCB Assembly WS; Value: 1uF
DL1 = DL_150060RS75000: LED Red 250mcd 0603 SMD; Manufacturer: WURTH ELEKTRONIK; Forward Current If: 30; Forward Voltage: 2; Lens Shape: Rectangular; Luminous Intensity: 250; Wavelength Typ: 625; Viewing Angle: 140°; LED Mounting: SMD; Supplier 1: Farnell; Supplier Part Number 1: 2322071; Manufacturer Part Number: 150060RS75000; Storage Location: PCB Assembly WS; Supplier: ECE Dept; LED Colour: Red
DL2 = DL_150060GS75000: LED Green 430mcd 0603 SMD; Manufacturer: WURTH ELEKTRONIK; Forward Current If: 30; Wavelength Typ: 520; Forward Voltage: 3.2; Lens Shape: Rectangular; Luminous Intensity: 430; Viewing Angle: 140°; LED Mounting: SMD; Supplier 1: Farnell; Supplier Part Number 1: 2322070; Manufacturer Part Number: 150060GS75000; Storage Location: PCB Assembly WS; Supplier: ECE Dept; LED Colour: Green
H4 = JS_USB_MICRO_B_SMT: CONN USB MICRO B RECPT SMT R/A; Manufacturer: FCI; Manufacturer Part Number: 10118194-0001LF; Gender: Receptacle; Number of Contacts: 5; Specifications: USB 2.0; Supplier 1: Digi-Key; Supplier Part Number 1: 609-4618-1-ND; Features: Shielded, Solder Retention; Mounting Type: Surface Mount, Right Angle, Horizontal
H5 = LED_Strip_Header: CONN HEADER 3POS 2.54mm VERT_Thru Hole; Manufacturer: Molex; Manufacturer PN: 22-23-2031; Supplier Part Number 1: 9731156; Supplier: ECE Dept; Supplier 1: Farnell; Storage Location: ECE Dept Store; Value: 3 Pin Molex KK Hdr
P2 P3 = JA_PIN_Header 2: Header, 2-Pin; LatestRevisionDate: 17-Jul-2002; LatestRevisionNote: Re-released for DXP Platform.; Publisher: Altium Limited
R6 = RS_27K: RES 27K OHM 1/10W 5% 0603 SMD; Storage Location: PCB Assembly WS; Supplier: ECE Dept; Value: 27K
R8 = RS_47K: RES 47.0K OHM 1/10W 5% 0603 SMD; Storage Location: PCB Assembly WS; Supplier: ECE Dept; Value: 47K
R12 = RS_3K3: RES 3.3K OHM 1/10W 5% 0603 SMD; Storage Location: PCB Assembly WS; Supplier: ECE Dept; Value: 3K3
R13 = RS_0R0: RES 0.0 OHM 1/10W 5% 0603 SMD; Storage Location: PCB Assembly WS; Supplier: ECE Dept; Value: 0R
R14 = RT_1R: RES 1R OHM 1/4W 5% 1206 SMD; Storage Location: PCB Assembly WS; Supplier: ECE Dept; Value: 1R
R15 = RS_2K: RES 2K OHM 1/10W 5% 0603 SMD; Storage Location: PCB Assembly WS; Supplier: ECE Dept; Value: 2K
S3 S4 = WS_EVQPNF05M: as S1 on sheet Wacky_Racers_87557913; PackageDescription: 6.0 x 3.5 mm; Supplier 1: Farnell; Supplier Part Number 1: 2079481; Manufacturer: Panasonic; Manufacturer PN: EVQPNF05M; Supplier 2: Digi-Key; Supplier Part Number 2: P13598SCT-ND; Storage Location: PCB Assembly WS; Supplier: ECE Dept
S5 = WS_SW DIP-4: DIP Switch, 4 Position, SPST SMD; Manufacturer: OMRON ELECTRONIC COMPONENTS; Manufacturer Part Number: A6SN-4101; Contact Current DC Max: 25; External Length / Height: 12.1; No. of Switch Positions: 4; Pitch Spacing: 2.54; Contact Configuration: SPST; Supplier 1: Farnell; Supplier Part Number 1: 2029425; Storage Location: PCB Assembly WS; Supplier: ECE Dept
U3 = SN74LVC1T45: 1.8V - 5V level converter
U4 = DRV8833: Dual H-Bridge Motor Driver 1.5A; ComponentLink1Description: DRV8833 Datasheet; ComponentLink1URL: \\maxwell\elecapp\AltiumDesigner\Libraries\DatasheetsNew\ENCE461\drv8833pwpr.pdf
U5 = NRF24: nRF24 SMD Module
U6 = SV_CAT6219-330TDGT3: as U2 on sheet Wacky_Racers_87557913; Manufacturer Part Number: CAT6219-330TDGT3; Base Part Number: CAT6219; Current - Output: 500mA; Package / Case: SOT-23-5 Thin, TSOT-23-5; Supplier: Digi-Key; Supplier Device Package: TSOT-23-5; Voltage - Output (Min/Fixed): 3.3V; ComponentLink1URL: http://www.onsemi.com/pub/Collateral/CAT6219-D.PDF; ComponentLink1Description: http://www.onsemi.com/pub/Collateral/CAT6219-D.PDF; Supplier 1: Digi-Key; ComponentLink2Description: CAT6219 Datasheet; ComponentLink2URL: \\maxwell\elecapp\AltiumDesigner\Libraries\DatasheetsNew\ENCE461\CAT6219-D.PDF

## Nets that join several sheets
3V3: Wacky_Racers_87557913 (19 pins), Wacky_Racers_extras (5 pins)
5V: Wacky_Racers_87557913 (5 pins), Wacky_Racers_extras (C23.2 H5.1 U3.1 U6.1)
GND: Wacky_Racers_87557913 (45 pins), Wacky_Racers_extras (19 pins)
VBAT: Wacky_Racers_87557913 (6 pins), Wacky_Racers_extras (C18.2 C19.2 U4.12)
D_N: Wacky_Racers_87557913 (R2.1), Wacky_Racers_extras (H4.2)
D_P: Wacky_Racers_87557913 (R1.1), Wacky_Racers_extras (H4.3)
DEBUG_SW_1: Wacky_Racers_87557913 (U1.34), Wacky_Racers_extras (Debug1.1 S3.2)
DEBUG_SW_2: Wacky_Racers_87557913 (U1.33), Wacky_Racers_extras (Debug2.1 S4.2)
LED_3V3: Wacky_Racers_87557913 (U1.49), Wacky_Racers_extras (3V_LED.1 U3.4)
PWM_IN_1: Wacky_Racers_87557913 (U1.9), Wacky_Racers_extras (PWM1.1 U4.16)
PWM_IN_2: Wacky_Racers_87557913 (U1.44), Wacky_Racers_extras (PWM2.1 U4.15)
PWM_IN_3: Wacky_Racers_87557913 (U1.48), Wacky_Racers_extras (PWM3.1 U4.9)
PWM_IN_4: Wacky_Racers_87557913 (U1.47), Wacky_Racers_extras (PWM4.1 U4.10)
Radio_CE: Wacky_Racers_87557913 (U1.29), Wacky_Racers_extras (RC_CE.1 U5.3)
Radio_CSN: Wacky_Racers_87557913 (U1.28), Wacky_Racers_extras (RC_CSN.1 U5.4)
Radio_Enable: Wacky_Racers_87557913 (U1.30), Wacky_Racers_extras (U6.3)
Radio_F_1: Wacky_Racers_87557913 (U1.15), Wacky_Racers_extras (RF1.1 S5.8)
Radio_F_2: Wacky_Racers_87557913 (U1.14), Wacky_Racers_extras (RF2.1 S5.7)
Radio_F_3: Wacky_Racers_87557913 (U1.37), Wacky_Racers_extras (RF3.1 S5.6)
Radio_F_4: Wacky_Racers_87557913 (U1.13), Wacky_Racers_extras (RF4.1 S5.5)
Radio_IRQ: Wacky_Racers_87557913 (U1.16), Wacky_Racers_extras (RC_IRQ.1 U5.8)
Radio_MISO: Wacky_Racers_87557913 (U1.27), Wacky_Racers_extras (RC_MISO.1 U5.7)
Radio_MOSI: Wacky_Racers_87557913 (U1.22), Wacky_Racers_extras (RC_MOSI.1 U5.6)
Radio_SCK: Wacky_Racers_87557913 (U1.21), Wacky_Racers_extras (U5.5)
STAT0: Wacky_Racers_87557913 (U1.63), Wacky_Racers_extras (R12.2 RED_LED.1)
STAT1: Wacky_Racers_87557913 (U1.52), Wacky_Racers_extras (GRE_LED.1 R15.2)
USB_DETECT: Wacky_Racers_87557913 (U1.59), Wacky_Racers_extras (R6.1 R8.2 USB_IN.1)